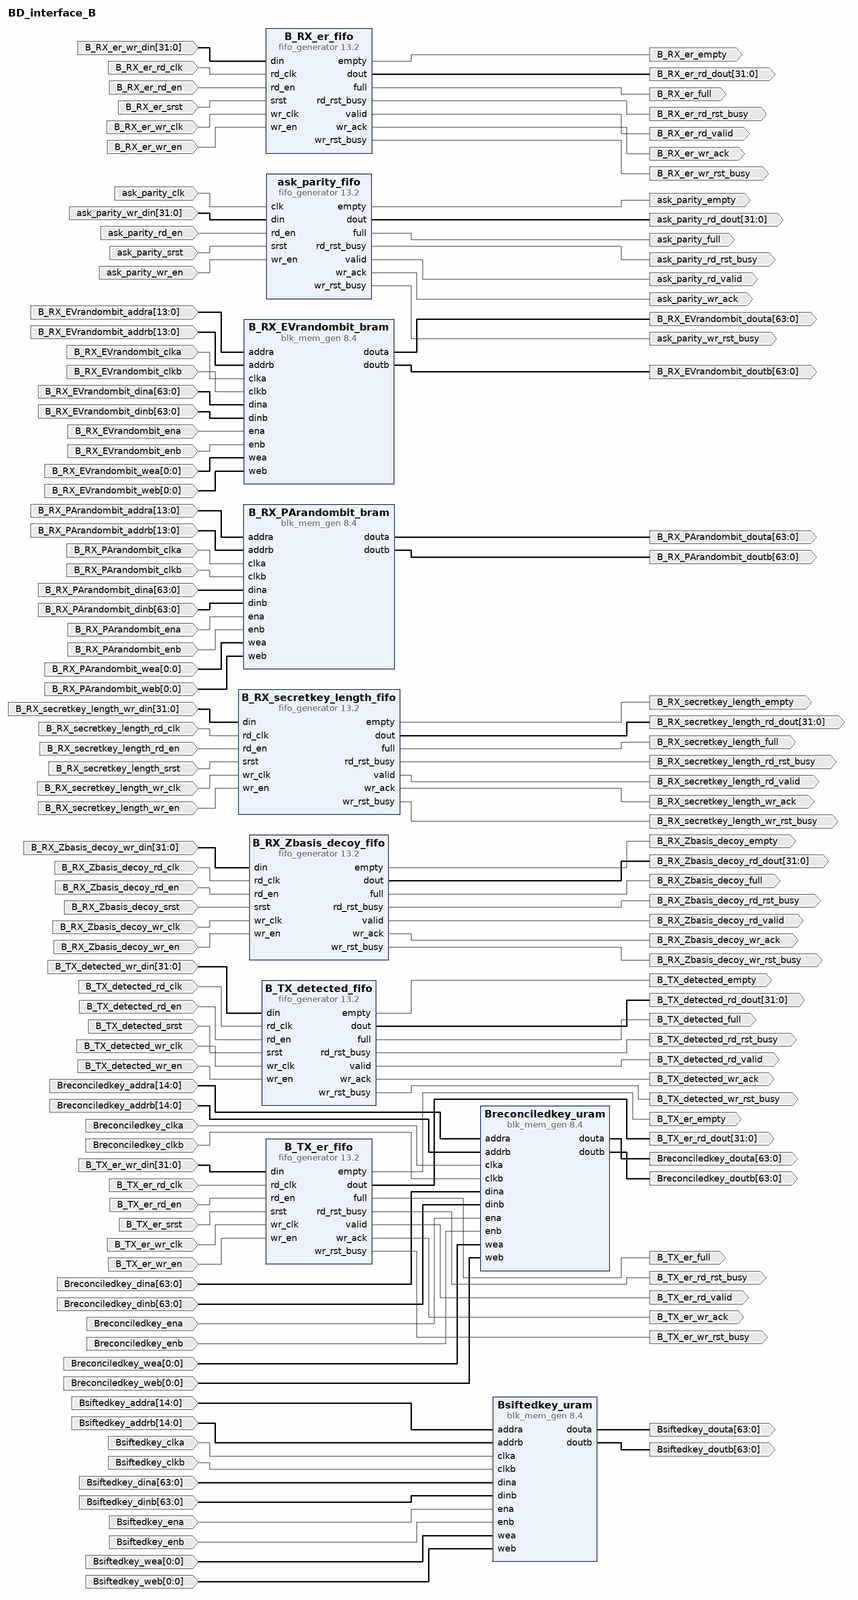
[diagram p0: block diagram of the top level]
# Vivado block design BD_interface_B, xcku5p-ffvb676-2-e, Vivado 2022.1
create_bd_design BD_interface_B

create_bd_port -dir I -from 14 -to 0 Breconciledkey_addra
create_bd_port -dir I -from 0 -to 0 Breconciledkey_wea
create_bd_port -dir I -from 63 -to 0 Breconciledkey_dinb
create_bd_port -dir O -from 63 -to 0 Breconciledkey_douta
create_bd_port -dir O -from 63 -to 0 Breconciledkey_doutb
create_bd_port -dir I -from 14 -to 0 Breconciledkey_addrb
create_bd_port -dir I Breconciledkey_ena
create_bd_port -dir I -type clk Breconciledkey_clkb
create_bd_port -dir I Breconciledkey_enb
create_bd_port -dir I -type clk Breconciledkey_clka
create_bd_port -dir I -from 63 -to 0 Breconciledkey_dina
create_bd_port -dir I -from 0 -to 0 Breconciledkey_web
create_bd_port -dir O -from 63 -to 0 B_RX_PArandombit_doutb
create_bd_port -dir I -from 13 -to 0 B_RX_PArandombit_addrb
create_bd_port -dir I -type clk B_RX_PArandombit_clkb
create_bd_port -dir I -type clk B_RX_PArandombit_clka
create_bd_port -dir I B_RX_PArandombit_enb
create_bd_port -dir I -from 63 -to 0 B_RX_PArandombit_dina
create_bd_port -dir I -from 0 -to 0 B_RX_PArandombit_web
create_bd_port -dir I -from 0 -to 0 B_RX_PArandombit_wea
create_bd_port -dir O -from 63 -to 0 B_RX_PArandombit_douta
create_bd_port -dir I B_RX_PArandombit_ena
create_bd_port -dir I -from 63 -to 0 B_RX_PArandombit_dinb
create_bd_port -dir I -from 13 -to 0 B_RX_PArandombit_addra
create_bd_port -dir I -from 0 -to 0 B_RX_EVrandombit_wea
create_bd_port -dir O -from 63 -to 0 B_RX_EVrandombit_doutb
create_bd_port -dir I B_RX_EVrandombit_ena
create_bd_port -dir I -from 63 -to 0 B_RX_EVrandombit_dinb
create_bd_port -dir I -type clk B_RX_EVrandombit_clkb
create_bd_port -dir O -from 63 -to 0 B_RX_EVrandombit_douta
create_bd_port -dir I -from 13 -to 0 B_RX_EVrandombit_addrb
create_bd_port -dir I B_RX_EVrandombit_enb
create_bd_port -dir I -from 63 -to 0 B_RX_EVrandombit_dina
create_bd_port -dir I -type clk B_RX_EVrandombit_clka
create_bd_port -dir I -from 13 -to 0 B_RX_EVrandombit_addra
create_bd_port -dir I -from 0 -to 0 B_RX_EVrandombit_web
create_bd_port -dir I -from 14 -to 0 Bsiftedkey_addrb
create_bd_port -dir I -type clk Bsiftedkey_clkb
create_bd_port -dir I -type clk Bsiftedkey_clka
create_bd_port -dir I Bsiftedkey_enb
create_bd_port -dir I -from 63 -to 0 Bsiftedkey_dina
create_bd_port -dir I -from 14 -to 0 Bsiftedkey_addra
create_bd_port -dir I -from 0 -to 0 Bsiftedkey_wea
create_bd_port -dir O -from 63 -to 0 Bsiftedkey_douta
create_bd_port -dir I Bsiftedkey_ena
create_bd_port -dir I -from 63 -to 0 Bsiftedkey_dinb
create_bd_port -dir O -from 63 -to 0 Bsiftedkey_doutb
create_bd_port -dir I -from 0 -to 0 Bsiftedkey_web
create_bd_port -dir I B_RX_Zbasis_decoy_srst
create_bd_port -dir I -type clk B_RX_Zbasis_decoy_wr_clk
create_bd_port -dir I -type clk B_RX_Zbasis_decoy_rd_clk
create_bd_port -dir O B_RX_Zbasis_decoy_wr_ack
create_bd_port -dir O B_RX_Zbasis_decoy_empty
create_bd_port -dir O -from 31 -to 0 B_RX_Zbasis_decoy_rd_dout
create_bd_port -dir I B_RX_Zbasis_decoy_rd_en
create_bd_port -dir O B_RX_Zbasis_decoy_rd_valid
create_bd_port -dir I -from 31 -to 0 B_RX_Zbasis_decoy_wr_din
create_bd_port -dir O B_RX_Zbasis_decoy_wr_rst_busy
create_bd_port -dir O B_RX_Zbasis_decoy_rd_rst_busy
create_bd_port -dir I B_RX_Zbasis_decoy_wr_en
create_bd_port -dir O B_RX_Zbasis_decoy_full
create_bd_port -dir I -type clk B_TX_er_rd_clk
create_bd_port -dir O B_TX_er_empty
create_bd_port -dir I B_TX_er_rd_en
create_bd_port -dir O -from 31 -to 0 B_TX_er_rd_dout
create_bd_port -dir O B_TX_er_wr_rst_busy
create_bd_port -dir O B_TX_er_rd_valid
create_bd_port -dir I B_TX_er_wr_en
create_bd_port -dir I -from 31 -to 0 B_TX_er_wr_din
create_bd_port -dir O B_TX_er_rd_rst_busy
create_bd_port -dir I -type clk B_TX_er_wr_clk
create_bd_port -dir I B_TX_er_srst
create_bd_port -dir O B_TX_er_wr_ack
create_bd_port -dir O B_TX_er_full
create_bd_port -dir I -type clk B_RX_er_rd_clk
create_bd_port -dir O B_RX_er_rd_rst_busy
create_bd_port -dir I B_RX_er_srst
create_bd_port -dir O B_RX_er_rd_valid
create_bd_port -dir O B_RX_er_wr_ack
create_bd_port -dir I -type clk B_RX_er_wr_clk
create_bd_port -dir O B_RX_er_wr_rst_busy
create_bd_port -dir I B_RX_er_rd_en
create_bd_port -dir O -from 31 -to 0 B_RX_er_rd_dout
create_bd_port -dir O B_RX_er_empty
create_bd_port -dir I B_RX_er_wr_en
create_bd_port -dir I -from 31 -to 0 B_RX_er_wr_din
create_bd_port -dir O B_RX_er_full
create_bd_port -dir I B_RX_secretkey_length_rd_en
create_bd_port -dir O B_RX_secretkey_length_empty
create_bd_port -dir I -type clk B_RX_secretkey_length_rd_clk
create_bd_port -dir O B_RX_secretkey_length_wr_ack
create_bd_port -dir I B_RX_secretkey_length_srst
create_bd_port -dir I -type clk B_RX_secretkey_length_wr_clk
create_bd_port -dir O B_RX_secretkey_length_rd_rst_busy
create_bd_port -dir I -from 31 -to 0 B_RX_secretkey_length_wr_din
create_bd_port -dir O B_RX_secretkey_length_rd_valid
create_bd_port -dir I B_RX_secretkey_length_wr_en
create_bd_port -dir O B_RX_secretkey_length_wr_rst_busy
create_bd_port -dir O -from 31 -to 0 B_RX_secretkey_length_rd_dout
create_bd_port -dir O B_RX_secretkey_length_full
create_bd_port -dir O B_TX_detected_rd_valid
create_bd_port -dir O B_TX_detected_rd_rst_busy
create_bd_port -dir O B_TX_detected_full
create_bd_port -dir I B_TX_detected_wr_en
create_bd_port -dir I -from 31 -to 0 B_TX_detected_wr_din
create_bd_port -dir O B_TX_detected_empty
create_bd_port -dir I -type clk B_TX_detected_wr_clk
create_bd_port -dir I B_TX_detected_rd_en
create_bd_port -dir I B_TX_detected_srst
create_bd_port -dir O -from 31 -to 0 B_TX_detected_rd_dout
create_bd_port -dir I -type clk B_TX_detected_rd_clk
create_bd_port -dir O B_TX_detected_wr_rst_busy
create_bd_port -dir O B_TX_detected_wr_ack
create_bd_port -dir I ask_parity_wr_en
create_bd_port -dir I -from 31 -to 0 ask_parity_wr_din
create_bd_port -dir O ask_parity_rd_rst_busy
create_bd_port -dir O ask_parity_wr_rst_busy
create_bd_port -dir O ask_parity_rd_valid
create_bd_port -dir O ask_parity_wr_ack
create_bd_port -dir I ask_parity_srst
create_bd_port -dir I -type clk ask_parity_clk
create_bd_port -dir I ask_parity_rd_en
create_bd_port -dir O -from 31 -to 0 ask_parity_rd_dout
create_bd_port -dir O ask_parity_empty
create_bd_port -dir O ask_parity_full

create_bd_cell -type ip -vlnv xilinx.com:ip:fifo_generator:13.2 B_TX_detected_fifo
set_property -dict [list \
  CONFIG.Fifo_Implementation Independent_Clocks_Builtin_FIFO \
  CONFIG.Input_Data_Width 32 \
  CONFIG.Input_Depth 2048 \
  CONFIG.Performance_Options First_Word_Fall_Through \
  CONFIG.Read_Clock_Frequency 125 \
  CONFIG.Valid_Flag true \
  CONFIG.Write_Acknowledge_Flag true \
  CONFIG.Write_Clock_Frequency 125 \
  CONFIG.enable_low_latency true \
  CONFIG.use_dout_register true \
] [get_bd_cells B_TX_detected_fifo]
create_bd_cell -type ip -vlnv xilinx.com:ip:fifo_generator:13.2 B_TX_er_fifo
set_property -dict [list \
  CONFIG.Fifo_Implementation Independent_Clocks_Builtin_FIFO \
  CONFIG.Input_Data_Width 32 \
  CONFIG.Input_Depth 2048 \
  CONFIG.Performance_Options First_Word_Fall_Through \
  CONFIG.Read_Clock_Frequency 125 \
  CONFIG.Valid_Flag true \
  CONFIG.Write_Acknowledge_Flag true \
  CONFIG.Write_Clock_Frequency 125 \
  CONFIG.enable_low_latency true \
  CONFIG.use_dout_register true \
] [get_bd_cells B_TX_er_fifo]
create_bd_cell -type ip -vlnv xilinx.com:ip:fifo_generator:13.2 B_RX_Zbasis_decoy_fifo
set_property -dict [list \
  CONFIG.Fifo_Implementation Independent_Clocks_Builtin_FIFO \
  CONFIG.Input_Data_Width 32 \
  CONFIG.Input_Depth 2048 \
  CONFIG.Performance_Options First_Word_Fall_Through \
  CONFIG.Read_Clock_Frequency 125 \
  CONFIG.Valid_Flag true \
  CONFIG.Write_Acknowledge_Flag true \
  CONFIG.Write_Clock_Frequency 125 \
  CONFIG.enable_low_latency true \
  CONFIG.use_dout_register true \
] [get_bd_cells B_RX_Zbasis_decoy_fifo]
create_bd_cell -type ip -vlnv xilinx.com:ip:fifo_generator:13.2 B_RX_er_fifo
set_property -dict [list \
  CONFIG.Fifo_Implementation Independent_Clocks_Builtin_FIFO \
  CONFIG.Input_Data_Width 32 \
  CONFIG.Input_Depth 2048 \
  CONFIG.Performance_Options First_Word_Fall_Through \
  CONFIG.Read_Clock_Frequency 125 \
  CONFIG.Valid_Flag true \
  CONFIG.Write_Acknowledge_Flag true \
  CONFIG.Write_Clock_Frequency 125 \
] [get_bd_cells B_RX_er_fifo]
create_bd_cell -type ip -vlnv xilinx.com:ip:fifo_generator:13.2 B_RX_secretkey_length_fifo
set_property -dict [list \
  CONFIG.Fifo_Implementation Independent_Clocks_Builtin_FIFO \
  CONFIG.Input_Data_Width 32 \
  CONFIG.Input_Depth 512 \
  CONFIG.Performance_Options First_Word_Fall_Through \
  CONFIG.Read_Clock_Frequency 125 \
  CONFIG.Valid_Flag true \
  CONFIG.Write_Acknowledge_Flag true \
  CONFIG.Write_Clock_Frequency 125 \
] [get_bd_cells B_RX_secretkey_length_fifo]
create_bd_cell -type ip -vlnv xilinx.com:ip:blk_mem_gen:8.4 B_RX_EVrandombit_bram
set_property -dict [list \
  CONFIG.Enable_32bit_Address false \
  CONFIG.Enable_B Use_ENB_Pin \
  CONFIG.Memory_Type True_Dual_Port_RAM \
  CONFIG.Port_B_Clock 100 \
  CONFIG.Port_B_Enable_Rate 100 \
  CONFIG.Port_B_Write_Rate 50 \
  CONFIG.Read_Width_A 64 \
  CONFIG.Read_Width_B 64 \
  CONFIG.Register_PortA_Output_of_Memory_Primitives false \
  CONFIG.Register_PortB_Output_of_Memory_Primitives false \
  CONFIG.Use_Byte_Write_Enable false \
  CONFIG.Use_RSTA_Pin false \
  CONFIG.Use_RSTB_Pin false \
  CONFIG.Write_Depth_A 16384 \
  CONFIG.Write_Width_A 64 \
  CONFIG.Write_Width_B 64 \
  CONFIG.use_bram_block Stand_Alone \
] [get_bd_cells B_RX_EVrandombit_bram]
create_bd_cell -type ip -vlnv xilinx.com:ip:blk_mem_gen:8.4 B_RX_PArandombit_bram
set_property -dict [list \
  CONFIG.Enable_32bit_Address false \
  CONFIG.Enable_B Use_ENB_Pin \
  CONFIG.Memory_Type True_Dual_Port_RAM \
  CONFIG.Port_B_Clock 100 \
  CONFIG.Port_B_Enable_Rate 100 \
  CONFIG.Port_B_Write_Rate 50 \
  CONFIG.Read_Width_A 64 \
  CONFIG.Read_Width_B 64 \
  CONFIG.Register_PortA_Output_of_Memory_Primitives false \
  CONFIG.Register_PortB_Output_of_Memory_Primitives false \
  CONFIG.Use_Byte_Write_Enable false \
  CONFIG.Use_RSTA_Pin false \
  CONFIG.Write_Depth_A 16384 \
  CONFIG.Write_Width_A 64 \
  CONFIG.Write_Width_B 64 \
  CONFIG.use_bram_block Stand_Alone \
] [get_bd_cells B_RX_PArandombit_bram]
create_bd_cell -type ip -vlnv xilinx.com:ip:blk_mem_gen:8.4 Bsiftedkey_uram
set_property -dict [list \
  CONFIG.Assume_Synchronous_Clk true \
  CONFIG.Enable_32bit_Address false \
  CONFIG.Enable_B Use_ENB_Pin \
  CONFIG.Memory_Type True_Dual_Port_RAM \
  CONFIG.Operating_Mode_A NO_CHANGE \
  CONFIG.Operating_Mode_B NO_CHANGE \
  CONFIG.PRIM_type_to_Implement BRAM \
  CONFIG.Port_B_Clock 100 \
  CONFIG.Port_B_Enable_Rate 100 \
  CONFIG.Port_B_Write_Rate 50 \
  CONFIG.Read_Width_A 64 \
  CONFIG.Read_Width_B 64 \
  CONFIG.Register_PortA_Output_of_Memory_Primitives true \
  CONFIG.Register_PortB_Output_of_Memory_Primitives true \
  CONFIG.Use_Byte_Write_Enable false \
  CONFIG.Use_RSTA_Pin false \
  CONFIG.Write_Depth_A 32768 \
  CONFIG.Write_Width_A 64 \
  CONFIG.Write_Width_B 64 \
  CONFIG.use_bram_block Stand_Alone \
] [get_bd_cells Bsiftedkey_uram]
create_bd_cell -type ip -vlnv xilinx.com:ip:blk_mem_gen:8.4 Breconciledkey_uram
set_property -dict [list \
  CONFIG.Assume_Synchronous_Clk true \
  CONFIG.Enable_32bit_Address false \
  CONFIG.Enable_B Use_ENB_Pin \
  CONFIG.Memory_Type True_Dual_Port_RAM \
  CONFIG.Operating_Mode_A NO_CHANGE \
  CONFIG.Operating_Mode_B NO_CHANGE \
  CONFIG.PRIM_type_to_Implement BRAM \
  CONFIG.Port_B_Clock 100 \
  CONFIG.Port_B_Enable_Rate 100 \
  CONFIG.Port_B_Write_Rate 50 \
  CONFIG.Read_Width_A 64 \
  CONFIG.Read_Width_B 64 \
  CONFIG.Register_PortA_Output_of_Memory_Primitives true \
  CONFIG.Register_PortB_Output_of_Memory_Primitives true \
  CONFIG.Use_Byte_Write_Enable false \
  CONFIG.Use_RSTA_Pin false \
  CONFIG.Write_Depth_A 32768 \
  CONFIG.Write_Width_A 64 \
  CONFIG.Write_Width_B 64 \
  CONFIG.use_bram_block Stand_Alone \
] [get_bd_cells Breconciledkey_uram]
create_bd_cell -type ip -vlnv xilinx.com:ip:fifo_generator:13.2 ask_parity_fifo
set_property -dict [list \
  CONFIG.Input_Data_Width 32 \
  CONFIG.Performance_Options First_Word_Fall_Through \
  CONFIG.Valid_Flag true \
  CONFIG.Write_Acknowledge_Flag true \
] [get_bd_cells ask_parity_fifo]

# ---- connections ----

connect_bd_net [get_bd_pins B_RX_EVrandombit_bram/douta] [get_bd_ports B_RX_EVrandombit_douta]
connect_bd_net [get_bd_pins B_RX_EVrandombit_bram/doutb] [get_bd_ports B_RX_EVrandombit_doutb]
connect_bd_net [get_bd_pins B_RX_PArandombit_bram/douta] [get_bd_ports B_RX_PArandombit_douta]
connect_bd_net [get_bd_pins B_RX_PArandombit_bram/doutb] [get_bd_ports B_RX_PArandombit_doutb]
connect_bd_net [get_bd_pins B_RX_Zbasis_decoy_fifo/dout] [get_bd_ports B_RX_Zbasis_decoy_rd_dout]
connect_bd_net [get_bd_pins B_RX_Zbasis_decoy_fifo/empty] [get_bd_ports B_RX_Zbasis_decoy_empty]
connect_bd_net [get_bd_pins B_RX_Zbasis_decoy_fifo/full] [get_bd_ports B_RX_Zbasis_decoy_full]
connect_bd_net [get_bd_pins B_RX_Zbasis_decoy_fifo/rd_rst_busy] [get_bd_ports B_RX_Zbasis_decoy_rd_rst_busy]
connect_bd_net [get_bd_pins B_RX_Zbasis_decoy_fifo/valid] [get_bd_ports B_RX_Zbasis_decoy_rd_valid]
connect_bd_net [get_bd_pins B_RX_Zbasis_decoy_fifo/wr_ack] [get_bd_ports B_RX_Zbasis_decoy_wr_ack]
connect_bd_net [get_bd_pins B_RX_Zbasis_decoy_fifo/wr_rst_busy] [get_bd_ports B_RX_Zbasis_decoy_wr_rst_busy]
connect_bd_net [get_bd_pins B_RX_er_fifo/dout] [get_bd_ports B_RX_er_rd_dout]
connect_bd_net [get_bd_pins B_RX_er_fifo/empty] [get_bd_ports B_RX_er_empty]
connect_bd_net [get_bd_pins B_RX_er_fifo/full] [get_bd_ports B_RX_er_full]
connect_bd_net [get_bd_pins B_RX_er_fifo/rd_rst_busy] [get_bd_ports B_RX_er_rd_rst_busy]
connect_bd_net [get_bd_pins B_RX_er_fifo/valid] [get_bd_ports B_RX_er_rd_valid]
connect_bd_net [get_bd_pins B_RX_er_fifo/wr_ack] [get_bd_ports B_RX_er_wr_ack]
connect_bd_net [get_bd_pins B_RX_er_fifo/wr_rst_busy] [get_bd_ports B_RX_er_wr_rst_busy]
connect_bd_net [get_bd_pins B_RX_secretkey_length_fifo/dout] [get_bd_ports B_RX_secretkey_length_rd_dout]
connect_bd_net [get_bd_pins B_RX_secretkey_length_fifo/empty] [get_bd_ports B_RX_secretkey_length_empty]
connect_bd_net [get_bd_pins B_RX_secretkey_length_fifo/full] [get_bd_ports B_RX_secretkey_length_full]
connect_bd_net [get_bd_pins B_RX_secretkey_length_fifo/rd_rst_busy] [get_bd_ports B_RX_secretkey_length_rd_rst_busy]
connect_bd_net [get_bd_pins B_RX_secretkey_length_fifo/valid] [get_bd_ports B_RX_secretkey_length_rd_valid]
connect_bd_net [get_bd_pins B_RX_secretkey_length_fifo/wr_ack] [get_bd_ports B_RX_secretkey_length_wr_ack]
connect_bd_net [get_bd_pins B_RX_secretkey_length_fifo/wr_rst_busy] [get_bd_ports B_RX_secretkey_length_wr_rst_busy]
connect_bd_net [get_bd_pins B_TX_detected_fifo/dout] [get_bd_ports B_TX_detected_rd_dout]
connect_bd_net [get_bd_pins B_TX_detected_fifo/empty] [get_bd_ports B_TX_detected_empty]
connect_bd_net [get_bd_pins B_TX_detected_fifo/full] [get_bd_ports B_TX_detected_full]
connect_bd_net [get_bd_pins B_TX_detected_fifo/rd_rst_busy] [get_bd_ports B_TX_detected_rd_rst_busy]
connect_bd_net [get_bd_pins B_TX_detected_fifo/valid] [get_bd_ports B_TX_detected_rd_valid]
connect_bd_net [get_bd_pins B_TX_detected_fifo/wr_ack] [get_bd_ports B_TX_detected_wr_ack]
connect_bd_net [get_bd_pins B_TX_detected_fifo/wr_rst_busy] [get_bd_ports B_TX_detected_wr_rst_busy]
connect_bd_net [get_bd_pins B_TX_er_fifo/dout] [get_bd_ports B_TX_er_rd_dout]
connect_bd_net [get_bd_pins B_TX_er_fifo/empty] [get_bd_ports B_TX_er_empty]
connect_bd_net [get_bd_pins B_TX_er_fifo/full] [get_bd_ports B_TX_er_full]
connect_bd_net [get_bd_pins B_TX_er_fifo/rd_rst_busy] [get_bd_ports B_TX_er_rd_rst_busy]
connect_bd_net [get_bd_pins B_TX_er_fifo/valid] [get_bd_ports B_TX_er_rd_valid]
connect_bd_net [get_bd_pins B_TX_er_fifo/wr_ack] [get_bd_ports B_TX_er_wr_ack]
connect_bd_net [get_bd_pins B_TX_er_fifo/wr_rst_busy] [get_bd_ports B_TX_er_wr_rst_busy]
connect_bd_net [get_bd_pins Breconciledkey_uram/douta] [get_bd_ports Breconciledkey_douta]
connect_bd_net [get_bd_pins Breconciledkey_uram/doutb] [get_bd_ports Breconciledkey_doutb]
connect_bd_net [get_bd_pins Bsiftedkey_uram/douta] [get_bd_ports Bsiftedkey_douta]
connect_bd_net [get_bd_pins Bsiftedkey_uram/doutb] [get_bd_ports Bsiftedkey_doutb]
connect_bd_net -net addra_0_1 [get_bd_ports Breconciledkey_addra] [get_bd_pins Breconciledkey_uram/addra]
connect_bd_net -net addra_0_2 [get_bd_ports B_RX_PArandombit_addra] [get_bd_pins B_RX_PArandombit_bram/addra]
connect_bd_net -net addra_0_3 [get_bd_ports B_RX_EVrandombit_addra] [get_bd_pins B_RX_EVrandombit_bram/addra]
connect_bd_net -net addra_0_4 [get_bd_ports Bsiftedkey_addra] [get_bd_pins Bsiftedkey_uram/addra]
connect_bd_net -net addrb_0_1 [get_bd_ports Breconciledkey_addrb] [get_bd_pins Breconciledkey_uram/addrb]
connect_bd_net -net addrb_0_2 [get_bd_ports B_RX_PArandombit_addrb] [get_bd_pins B_RX_PArandombit_bram/addrb]
connect_bd_net -net addrb_0_3 [get_bd_ports B_RX_EVrandombit_addrb] [get_bd_pins B_RX_EVrandombit_bram/addrb]
connect_bd_net -net addrb_0_4 [get_bd_ports Bsiftedkey_addrb] [get_bd_pins Bsiftedkey_uram/addrb]
connect_bd_net [get_bd_pins ask_parity_fifo/dout] [get_bd_ports ask_parity_rd_dout]
connect_bd_net [get_bd_pins ask_parity_fifo/empty] [get_bd_ports ask_parity_empty]
connect_bd_net [get_bd_pins ask_parity_fifo/full] [get_bd_ports ask_parity_full]
connect_bd_net [get_bd_pins ask_parity_fifo/rd_rst_busy] [get_bd_ports ask_parity_rd_rst_busy]
connect_bd_net [get_bd_pins ask_parity_fifo/valid] [get_bd_ports ask_parity_rd_valid]
connect_bd_net [get_bd_pins ask_parity_fifo/wr_ack] [get_bd_ports ask_parity_wr_ack]
connect_bd_net [get_bd_pins ask_parity_fifo/wr_rst_busy] [get_bd_ports ask_parity_wr_rst_busy]
connect_bd_net -net clk_0_1 [get_bd_ports ask_parity_clk] [get_bd_pins ask_parity_fifo/clk]
connect_bd_net -net clka_0_1 [get_bd_ports Breconciledkey_clka] [get_bd_pins Breconciledkey_uram/clka]
connect_bd_net -net clka_0_2 [get_bd_ports B_RX_PArandombit_clka] [get_bd_pins B_RX_PArandombit_bram/clka]
connect_bd_net -net clka_0_3 [get_bd_ports B_RX_EVrandombit_clka] [get_bd_pins B_RX_EVrandombit_bram/clka]
connect_bd_net -net clka_0_4 [get_bd_ports Bsiftedkey_clka] [get_bd_pins Bsiftedkey_uram/clka]
connect_bd_net -net clkb_0_1 [get_bd_ports Breconciledkey_clkb] [get_bd_pins Breconciledkey_uram/clkb]
connect_bd_net -net clkb_0_2 [get_bd_ports B_RX_PArandombit_clkb] [get_bd_pins B_RX_PArandombit_bram/clkb]
connect_bd_net -net clkb_0_3 [get_bd_ports B_RX_EVrandombit_clkb] [get_bd_pins B_RX_EVrandombit_bram/clkb]
connect_bd_net -net clkb_0_4 [get_bd_ports Bsiftedkey_clkb] [get_bd_pins Bsiftedkey_uram/clkb]
connect_bd_net -net din_0_1 [get_bd_ports B_RX_Zbasis_decoy_wr_din] [get_bd_pins B_RX_Zbasis_decoy_fifo/din]
connect_bd_net -net din_0_2 [get_bd_ports B_TX_er_wr_din] [get_bd_pins B_TX_er_fifo/din]
connect_bd_net -net din_0_3 [get_bd_ports B_RX_er_wr_din] [get_bd_pins B_RX_er_fifo/din]
connect_bd_net -net din_0_4 [get_bd_ports B_RX_secretkey_length_wr_din] [get_bd_pins B_RX_secretkey_length_fifo/din]
connect_bd_net -net din_0_5 [get_bd_ports B_TX_detected_wr_din] [get_bd_pins B_TX_detected_fifo/din]
connect_bd_net -net din_0_6 [get_bd_ports ask_parity_wr_din] [get_bd_pins ask_parity_fifo/din]
connect_bd_net -net dina_0_1 [get_bd_ports Breconciledkey_dina] [get_bd_pins Breconciledkey_uram/dina]
connect_bd_net -net dina_0_2 [get_bd_ports B_RX_PArandombit_dina] [get_bd_pins B_RX_PArandombit_bram/dina]
connect_bd_net -net dina_0_3 [get_bd_ports B_RX_EVrandombit_dina] [get_bd_pins B_RX_EVrandombit_bram/dina]
connect_bd_net -net dina_0_4 [get_bd_ports Bsiftedkey_dina] [get_bd_pins Bsiftedkey_uram/dina]
connect_bd_net -net dinb_0_1 [get_bd_ports Breconciledkey_dinb] [get_bd_pins Breconciledkey_uram/dinb]
connect_bd_net -net dinb_0_2 [get_bd_ports B_RX_PArandombit_dinb] [get_bd_pins B_RX_PArandombit_bram/dinb]
connect_bd_net -net dinb_0_3 [get_bd_ports B_RX_EVrandombit_dinb] [get_bd_pins B_RX_EVrandombit_bram/dinb]
connect_bd_net -net dinb_0_4 [get_bd_ports Bsiftedkey_dinb] [get_bd_pins Bsiftedkey_uram/dinb]
connect_bd_net -net ena_0_1 [get_bd_ports Breconciledkey_ena] [get_bd_pins Breconciledkey_uram/ena]
connect_bd_net -net ena_0_2 [get_bd_ports B_RX_PArandombit_ena] [get_bd_pins B_RX_PArandombit_bram/ena]
connect_bd_net -net ena_0_3 [get_bd_ports B_RX_EVrandombit_ena] [get_bd_pins B_RX_EVrandombit_bram/ena]
connect_bd_net -net ena_0_4 [get_bd_ports Bsiftedkey_ena] [get_bd_pins Bsiftedkey_uram/ena]
connect_bd_net -net enb_0_1 [get_bd_ports Breconciledkey_enb] [get_bd_pins Breconciledkey_uram/enb]
connect_bd_net -net enb_0_2 [get_bd_ports B_RX_PArandombit_enb] [get_bd_pins B_RX_PArandombit_bram/enb]
connect_bd_net -net enb_0_3 [get_bd_ports B_RX_EVrandombit_enb] [get_bd_pins B_RX_EVrandombit_bram/enb]
connect_bd_net -net enb_0_4 [get_bd_ports Bsiftedkey_enb] [get_bd_pins Bsiftedkey_uram/enb]
connect_bd_net -net rd_clk_0_1 [get_bd_ports B_RX_Zbasis_decoy_rd_clk] [get_bd_pins B_RX_Zbasis_decoy_fifo/rd_clk]
connect_bd_net -net rd_clk_0_2 [get_bd_ports B_TX_er_rd_clk] [get_bd_pins B_TX_er_fifo/rd_clk]
connect_bd_net -net rd_clk_0_3 [get_bd_ports B_RX_er_rd_clk] [get_bd_pins B_RX_er_fifo/rd_clk]
connect_bd_net -net rd_clk_0_4 [get_bd_ports B_RX_secretkey_length_rd_clk] [get_bd_pins B_RX_secretkey_length_fifo/rd_clk]
connect_bd_net -net rd_clk_0_5 [get_bd_ports B_TX_detected_rd_clk] [get_bd_pins B_TX_detected_fifo/rd_clk]
connect_bd_net -net rd_en_0_1 [get_bd_ports B_RX_Zbasis_decoy_rd_en] [get_bd_pins B_RX_Zbasis_decoy_fifo/rd_en]
connect_bd_net -net rd_en_0_2 [get_bd_ports B_TX_er_rd_en] [get_bd_pins B_TX_er_fifo/rd_en]
connect_bd_net -net rd_en_0_3 [get_bd_ports B_RX_er_rd_en] [get_bd_pins B_RX_er_fifo/rd_en]
connect_bd_net -net rd_en_0_4 [get_bd_ports B_RX_secretkey_length_rd_en] [get_bd_pins B_RX_secretkey_length_fifo/rd_en]
connect_bd_net -net rd_en_0_5 [get_bd_ports B_TX_detected_rd_en] [get_bd_pins B_TX_detected_fifo/rd_en]
connect_bd_net -net rd_en_0_6 [get_bd_ports ask_parity_rd_en] [get_bd_pins ask_parity_fifo/rd_en]
connect_bd_net -net srst_0_1 [get_bd_ports B_RX_Zbasis_decoy_srst] [get_bd_pins B_RX_Zbasis_decoy_fifo/srst]
connect_bd_net -net srst_0_2 [get_bd_ports B_TX_er_srst] [get_bd_pins B_TX_er_fifo/srst]
connect_bd_net -net srst_0_3 [get_bd_ports B_RX_er_srst] [get_bd_pins B_RX_er_fifo/srst]
connect_bd_net -net srst_0_4 [get_bd_ports B_RX_secretkey_length_srst] [get_bd_pins B_RX_secretkey_length_fifo/srst]
connect_bd_net -net srst_0_5 [get_bd_ports B_TX_detected_srst] [get_bd_pins B_TX_detected_fifo/srst]
connect_bd_net -net srst_0_6 [get_bd_ports ask_parity_srst] [get_bd_pins ask_parity_fifo/srst]
connect_bd_net -net wea_0_1 [get_bd_ports Breconciledkey_wea] [get_bd_pins Breconciledkey_uram/wea]
connect_bd_net -net wea_0_2 [get_bd_ports B_RX_PArandombit_wea] [get_bd_pins B_RX_PArandombit_bram/wea]
connect_bd_net -net wea_0_3 [get_bd_ports B_RX_EVrandombit_wea] [get_bd_pins B_RX_EVrandombit_bram/wea]
connect_bd_net -net wea_0_4 [get_bd_ports Bsiftedkey_wea] [get_bd_pins Bsiftedkey_uram/wea]
connect_bd_net -net web_0_1 [get_bd_ports Breconciledkey_web] [get_bd_pins Breconciledkey_uram/web]
connect_bd_net -net web_0_2 [get_bd_ports B_RX_PArandombit_web] [get_bd_pins B_RX_PArandombit_bram/web]
connect_bd_net -net web_0_3 [get_bd_ports B_RX_EVrandombit_web] [get_bd_pins B_RX_EVrandombit_bram/web]
connect_bd_net -net web_0_4 [get_bd_ports Bsiftedkey_web] [get_bd_pins Bsiftedkey_uram/web]
connect_bd_net -net wr_clk_0_1 [get_bd_ports B_RX_Zbasis_decoy_wr_clk] [get_bd_pins B_RX_Zbasis_decoy_fifo/wr_clk]
connect_bd_net -net wr_clk_0_2 [get_bd_ports B_TX_er_wr_clk] [get_bd_pins B_TX_er_fifo/wr_clk]
connect_bd_net -net wr_clk_0_3 [get_bd_ports B_RX_er_wr_clk] [get_bd_pins B_RX_er_fifo/wr_clk]
connect_bd_net -net wr_clk_0_4 [get_bd_ports B_RX_secretkey_length_wr_clk] [get_bd_pins B_RX_secretkey_length_fifo/wr_clk]
connect_bd_net -net wr_clk_0_5 [get_bd_ports B_TX_detected_wr_clk] [get_bd_pins B_TX_detected_fifo/wr_clk]
connect_bd_net -net wr_en_0_1 [get_bd_ports B_RX_Zbasis_decoy_wr_en] [get_bd_pins B_RX_Zbasis_decoy_fifo/wr_en]
connect_bd_net -net wr_en_0_2 [get_bd_ports B_TX_er_wr_en] [get_bd_pins B_TX_er_fifo/wr_en]
connect_bd_net -net wr_en_0_3 [get_bd_ports B_RX_er_wr_en] [get_bd_pins B_RX_er_fifo/wr_en]
connect_bd_net -net wr_en_0_4 [get_bd_ports B_RX_secretkey_length_wr_en] [get_bd_pins B_RX_secretkey_length_fifo/wr_en]
connect_bd_net -net wr_en_0_5 [get_bd_ports B_TX_detected_wr_en] [get_bd_pins B_TX_detected_fifo/wr_en]
connect_bd_net -net wr_en_0_6 [get_bd_ports ask_parity_wr_en] [get_bd_pins ask_parity_fifo/wr_en]

validate_bd_design
save_bd_design
